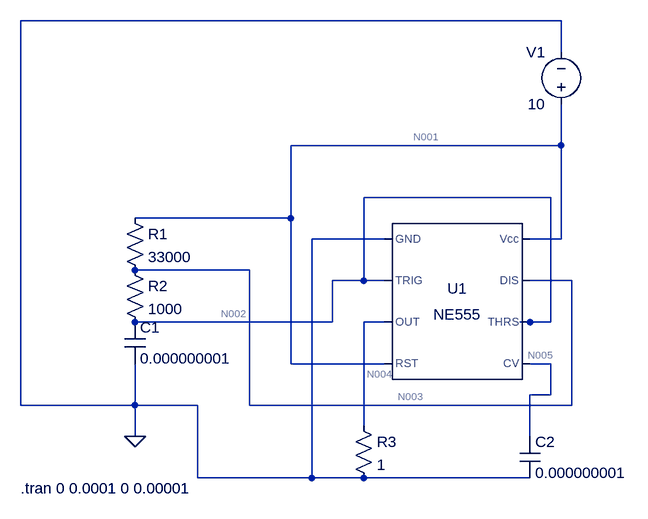
[diagram p0: schematic 555.asc]
555.asc, the LTspice schematic file:
Version 4
SHEET 1 880 680
WIRE 288 -272 -544 -272
WIRE 288 -224 288 -272
WIRE 288 -80 288 -144
WIRE 288 -80 -128 -80
WIRE 272 0 -16 0
WIRE -128 32 -128 -80
WIRE -128 32 -368 32
WIRE 16 64 -96 64
WIRE 288 64 288 -80
WIRE 288 64 240 64
WIRE -192 112 -368 112
WIRE -16 128 -16 0
WIRE -16 128 -64 128
WIRE 16 128 -16 128
WIRE 304 128 240 128
WIRE -64 192 -64 128
WIRE -64 192 -368 192
WIRE 16 192 -16 192
WIRE 240 192 224 192
WIRE 272 192 272 0
WIRE 272 192 240 192
WIRE -128 256 -128 32
WIRE 16 256 -128 256
WIRE 272 256 240 256
WIRE 272 304 272 256
WIRE 272 304 240 304
WIRE -544 320 -544 -272
WIRE -368 320 -368 256
WIRE -368 320 -544 320
WIRE -272 320 -368 320
WIRE -192 320 -192 112
WIRE 304 320 304 128
WIRE 304 320 -192 320
WIRE -16 352 -16 192
WIRE -368 368 -368 320
WIRE 240 368 240 304
WIRE -272 432 -272 320
WIRE -96 432 -96 64
WIRE -96 432 -272 432
WIRE -16 432 -96 432
WIRE 240 432 -16 432
FLAG -368 368 0
SYMBOL Misc\\NE555 128 160 R0
SYMATTR InstName U1
SYMBOL res -384 16 R0
SYMATTR InstName R1
SYMATTR Value 33000
SYMBOL res -384 96 R0
SYMATTR InstName R2
SYMATTR Value 1000
SYMBOL cap -384 192 R0
SYMATTR InstName C1
SYMATTR Value 0.000000001
SYMBOL cap 224 368 R0
SYMATTR InstName C2
SYMATTR Value 0.000000001
SYMBOL res -32 336 R0
SYMATTR InstName R3
SYMATTR Value 1
SYMBOL voltage 288 -128 R180
WINDOW 0 24 96 Left 2
WINDOW 3 24 16 Left 2
WINDOW 123 0 0 Left 0
WINDOW 39 0 0 Left 0
SYMATTR InstName V1
SYMATTR Value 10
TEXT -544 448 Left 2 !.tran 0 0.0001 0 0.00001

The netlist it stands for:
* 555.asc
XU1 0 N002 N004 N001 N005 N002 N003 N001 NE555  ; pins GND TRIG OUT RST CV THRS DIS Vcc
R1 N001 N003 33000
R2 N003 N002 1000
C1 N002 0 0.000000001
C2 N005 0 0.000000001
R3 N004 0 1
V1 N001 0 10
.tran 0 0.0001 0 0.00001
.lib NE555.sub
.backanno
.end

* Results of the author's LTspice run, read from the files saved beside the schematic
* Operating Point, zero values left out:
*   V(n002) = 9.999 V
*   V(n005) = 6.667 V
*   V(n001) = 10 V
*   V(n003) = 9.999 V
*   V(n004) = 1.429 V
*   I(R3) = 1.429 A
*   I(R2) = 20 nA
*   I(R1) = 33.34 nA
*   I(V1) = -1.432 A
*   Ix(u1:1) = -3.224 mA
*   Ix(u1:2) = 9.999 nA
*   Ix(u1:3) = -1.429 A
*   Ix(u1:4) = 56 µA
*   Ix(u1:6) = 9.999 nA
*   Ix(u1:7) = 13.34 nA
*   Ix(u1:8) = 1.432 A
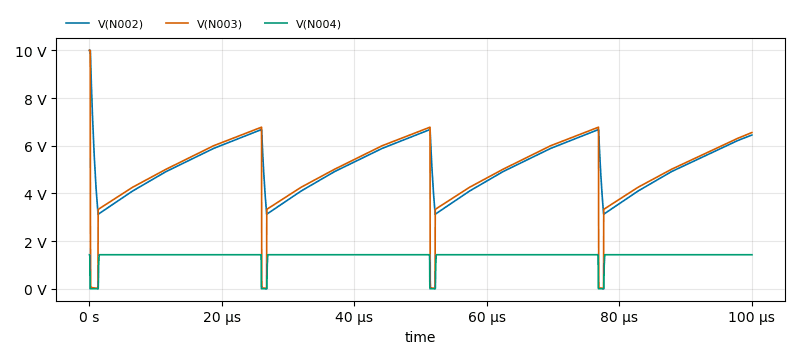
[diagram p1: Transient Analysis of 555.asc, plotted from the saved traces]
* Transient Analysis, 1 run:
*   V(N002): min 3.123 V, max 9.999 V, average 5.073 V, rms 5.193 V, last 6.448 V
*   V(N003): min 20.87 mV, max 9.999 V, average 5.02 V, rms 5.211 V, last 6.553 V
*   V(N004): min 8.571 µV, max 1.429 V, average 1.371 V, rms 1.399 V, last 1.429 V